# Altium schematic sheet MyFly1.SchDoc: MyFly
size A4; Author: Xuedong; DocumentNumber: 1; Revision: V1.0; SheetNumber: 1; SheetTotal: 2
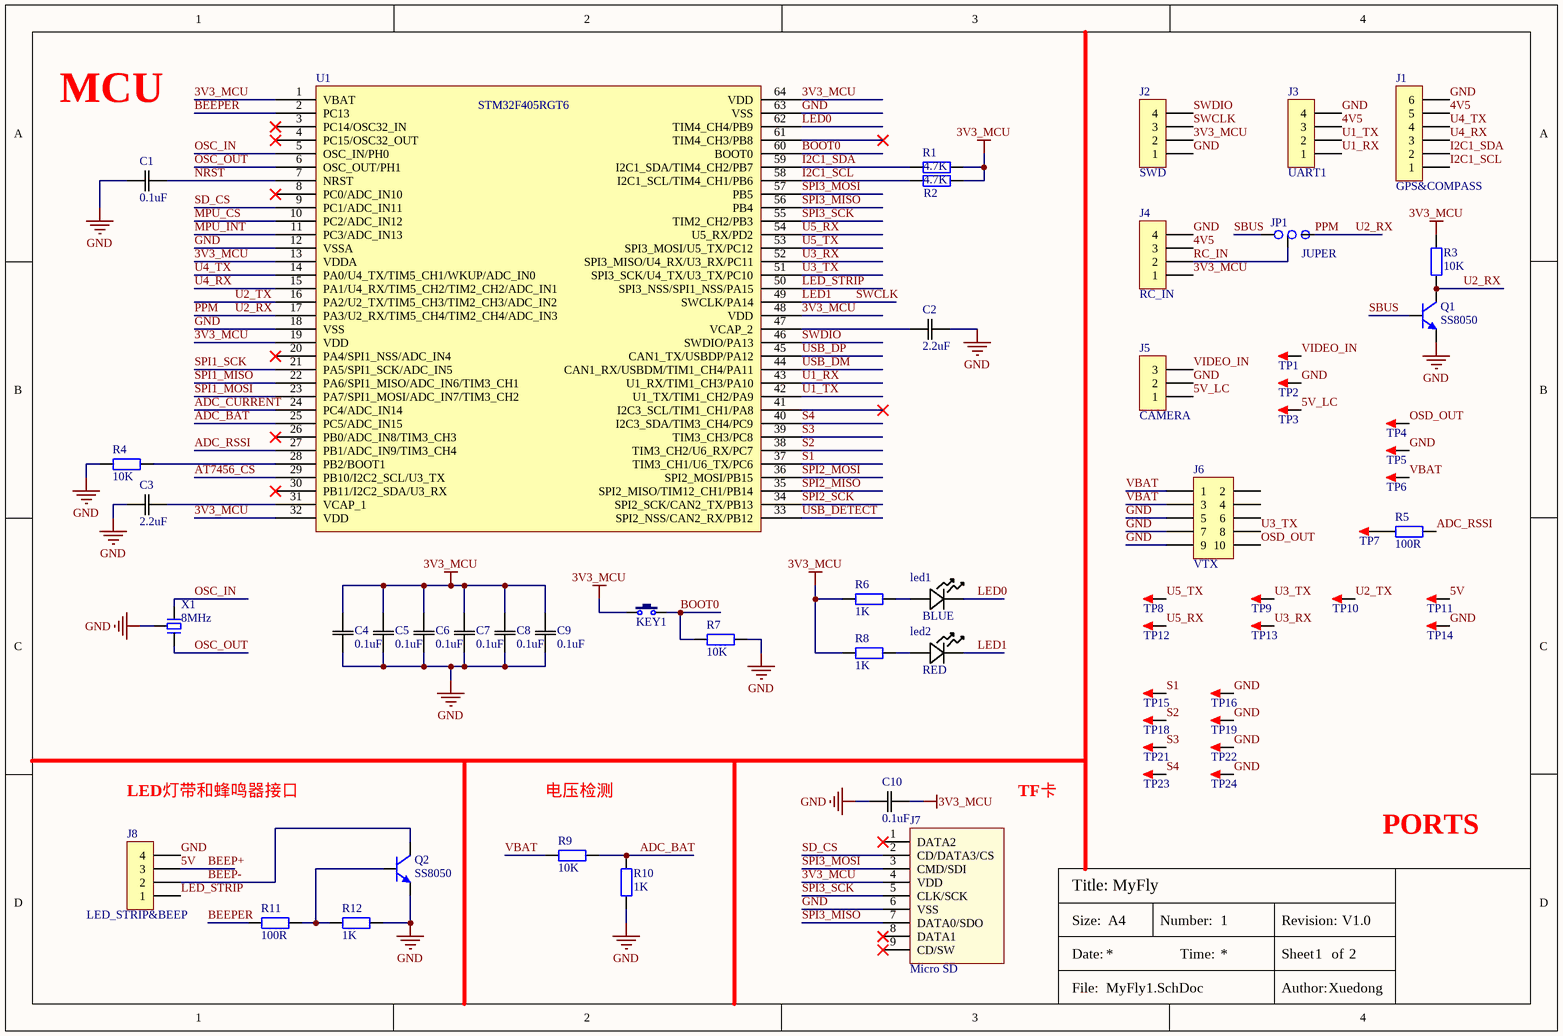
[diagram p0: MyFly1.SchDoc]

## Parts
C1  0.1uF  [CAP_0402]
C2  2.2uF  [CAP_0402]
C3  2.2uF  [CAP_0402]
C4  0.1uF  [CAP_0402]
C5  0.1uF  [CAP_0402]
C6  0.1uF  [CAP_0402]
C7  0.1uF  [CAP_0402]
C8  0.1uF  [CAP_0402]
C9  0.1uF  [CAP_0402]
C10  0.1uF  [CAP_0603]
J1  GPS&COMPASS  [SH1.0 S-W-6P]
J2  SWD  [SH1.0 S-W-4P]
J3  UART1  [SH1.0 S-W-4P]
J4  RC_IN  [SH1.0 S-W-4P]
J5  CAMERA  [MX 1.25-WS-3P]
J6  VTX  [HDR1.27 2x5-M-SMD]
J7  Micro SD  [MICRO SD]
J8  LED_STRIP&BEEP  [SH1.0 S-W-4P]
JP1  JUPER  [JUMPER 3P]
KEY1  KEY  [KEY_TSW 2*4*3.5-S-W]  (value not drawn)
led1  BLUE  [LED_0603]
led2  RED  [LED_0603]
Q1  SS8050  [SOT23-3L]
Q2  SS8050  [SOT23-3L]
R1  4.7K  [Res_0402]
R2  4.7K  [Res_0402]
R3  10K  [Res_0402]
R4  10K  [Res_0402]
R5  100R  [Res_0402]
R6  1K  [Res_0402]
R7  10K  [Res_0402]
R8  1K  [Res_0402]
R9  10K  [RES_0603]
R10  1K  [RES_0603]
R11  100R  [Res_0402]
R12  1K  [Res_0402]
TP1  TEST  [TEST PAD 1.8]  (value not drawn)
TP2  TEST  [TEST PAD 1.8]  (value not drawn)
TP3  TEST  [TEST PAD 1.8]  (value not drawn)
TP4  TEST  [TEST PAD 1.8]  (value not drawn)
TP5  TEST  [TEST PAD 1.8]  (value not drawn)
TP6  TEST  [TEST PAD 1.8]  (value not drawn)
TP7  TEST  [TEST PAD 1.8]  (value not drawn)
TP8  TEST  [TEST PAD 1.8]  (value not drawn)
TP9  TEST  [TEST PAD 1.8]  (value not drawn)
TP10  TEST  [TEST PAD 1.8]  (value not drawn)
TP11  TEST  [TEST PAD 1.8]  (value not drawn)
TP12  TEST  [TEST PAD 1.8]  (value not drawn)
TP13  TEST  [TEST PAD 1.8]  (value not drawn)
TP14  TEST  [TEST PAD 1.8]  (value not drawn)
TP15  TEST  [TEST PAD 1.8]  (value not drawn)
TP16  TEST  [TEST PAD 1.8]  (value not drawn)
TP18  TEST  [TEST PAD 1.8]  (value not drawn)
TP19  TEST  [TEST PAD 1.8]  (value not drawn)
TP21  TEST  [TEST PAD 1.8]  (value not drawn)
TP22  TEST  [TEST PAD 1.8]  (value not drawn)
TP23  TEST  [TEST PAD 1.8]  (value not drawn)
TP24  TEST  [TEST PAD 1.8]  (value not drawn)
U1  STM32F405RGT6  [LQFP-64]
X1  8MHz  [XTAL-3215-3P]

## Nets
3V3_MCU: C4.2(EPAD) C5.2(EPAD) C6.2(EPAD) C7.2(EPAD) C8.2(EPAD) C9.2(EPAD) C10.2(EPAD) J2.2 J4.1 J7.4(VDD) KEY1.1 R1.2 R2.2 R3.2 R6.1 R8.1 U1.1(VBAT) U1.13(VDDA) U1.19(VDD) U1.32(VDD) U1.48(VDD) U1.64(VDD)
GND: C1.1(EPAD) C2.2(EPAD) C3.1(EPAD) C4.1(EPAD) C5.1(EPAD) C6.1(EPAD) C7.1(EPAD) C8.1(EPAD) C9.1(EPAD) C10.1(EPAD) J1.6 J2.1 J3.4 J4.4 J5.2 J6.5 J6.7 J6.9 J7.6(VSS) J8.4 Q1.2(E) Q2.2(E) R4.1 R7.2 R10.1 R12.2 TP2.1 TP5.1 TP14.1 TP16.1 TP19.1 TP22.1 TP24.1 U1.12(VSSA) U1.18(VSS) U1.63(VSS) X1.2
4V5: J1.5 J3.3 J4.3
5V: J8.3 TP11.1  [also labelled BEEP+]
5V_LC: J5.1 TP3.1
ADC_BAT: R9.2 R10.2 U1.25(PC5/ADC_IN15)
ADC_CURRENT: U1.24(PC4/ADC_IN14)
ADC_RSSI: R5.2 U1.27(PB1/ADC_IN9/TIM3_CH4)
AT7456_CS: U1.29(PB10/I2C2_SCL/U3_TX)
BEEP-: J8.2 Q2.3(C)
BEEPER: R11.1 U1.2(PC13)
BOOT0: KEY1.2 R7.1 U1.60(BOOT0)
I2C1_SCL: J1.1 R2.1 U1.58(I2C1_SCL/TIM4_CH1/PB6)
I2C1_SDA: J1.2 R1.1 U1.59(I2C1_SDA/TIM4_CH2/PB7)
LED0: led1.1 U1.62(TIM4_CH4/PB9)
LED1: J2.3 led2.1 U1.49(SWCLK/PA14)  [also labelled SWCLK]
LED_STRIP: J8.1 U1.50(SPI3_NSS/SPI1_NSS/PA15)
MPU_CS: U1.10(PC2/ADC_IN12)
MPU_INT: U1.11(PC3/ADC_IN13)
NRST: C1.2(EPAD) U1.7(NRST)
OSC_IN: U1.5(OSC_IN/PH0) X1.1
OSC_OUT: U1.6(OSC_OUT/PH1) X1.3
OSD_OUT: J6.10 TP4.1
PPM: JP1.3 Q1.3(C) R3.1 U1.17(PA3/U2_RX/TIM5_CH4/TIM2_CH4/ADC_IN3)  [also labelled U2_RX]
RC_IN: J4.2 JP1.2
S1: TP15.1 U1.37(TIM3_CH1/U6_TX/PC6)
S2: TP18.1 U1.38(TIM3_CH2/U6_RX/PC7)
S3: TP21.1 U1.39(TIM3_CH3/PC8)
S4: TP23.1 U1.40(I2C3_SDA/TIM3_CH4/PC9)
SBUS: JP1.1 Q1.1(B)
SD_CS: J7.2(CD/DATA3/CS) U1.9(PC1/ADC_IN11)
SPI1_MISO: U1.22(PA6/SPI1_MISO/ADC_IN6/TIM3_CH1)
SPI1_MOSI: U1.23(PA7/SPI1_MOSI/ADC_IN7/TIM3_CH2)
SPI1_SCK: U1.21(PA5/SPI1_SCK/ADC_IN5)
SPI2_MISO: U1.35(SPI2_MISO/TIM12_CH1/PB14)
SPI2_MOSI: U1.36(SPI2_MOSI/PB15)
SPI2_SCK: U1.34(SPI2_SCK/CAN2_TX/PB13)
SPI3_MISO: J7.7(DATA0/SDO) U1.56(PB4)
SPI3_MOSI: J7.3(CMD/SDI) U1.57(PB5)
SPI3_SCK: J7.5(CLK/SCK) U1.55(TIM2_CH2/PB3)
SWDIO: J2.4 U1.46(SWDIO/PA13)
U1_RX: J3.1 U1.43(U1_RX/TIM1_CH3/PA10)
U1_TX: J3.2 U1.42(U1_TX/TIM1_CH2/PA9)
U2_TX: TP10.1 U1.16(PA2/U2_TX/TIM5_CH3/TIM2_CH3/ADC_IN2)
U3_RX: TP13.1 U1.52(SPI3_MISO/U4_RX/U3_RX/PC11)
U3_TX: J6.8 TP9.1 U1.51(SPI3_SCK/U4_TX/U3_TX/PC10)
U4_RX: J1.3 U1.15(PA1/U4_RX/TIM5_CH2/TIM2_CH2/ADC_IN1)
U4_TX: J1.4 U1.14(PA0/U4_TX/TIM5_CH1/WKUP/ADC_IN0)
U5_RX: TP12.1 U1.54(U5_RX/PD2)
U5_TX: TP8.1 U1.53(SPI3_MOSI/U5_TX/PC12)
USB_DETECT: U1.33(SPI2_NSS/CAN2_RX/PB12)
USB_DM: U1.44(CAN1_RX/USBDM/TIM1_CH4/PA11)
USB_DP: U1.45(CAN1_TX/USBDP/PA12)
VBAT: J6.1 J6.3 R9.1 TP6.1
VIDEO_IN: J5.3 TP1.1
NetC2_1: C2.1(EPAD) U1.47(VCAP_2)
NetC3_2: C3.2(EPAD) U1.31(VCAP_1)
Netled1_2: led1.2 R6.2
Netled2_2: led2.2 R8.2
NetQ2_1: Q2.1(B) R11.2 R12.1
NetR4_2: R4.2 U1.28(PB2/BOOT1)
NetR5_1: R5.1 TP7.1

Not connected (* = marked no-connect by the designer): J6 2 4 6; J7 1(DATA2)* 8(DATA1)* 9(CD/SW)*; U1 3(PC14/OSC32_IN)* 4(PC15/OSC32_OUT)* 8(PC0/ADC_IN10)* 20(PA4/SPI1_NSS/ADC_IN4)* 26(PB0/ADC_IN8/TIM3_CH3)* 30(PB11/I2C2_SDA/U3_RX)* 41(I2C3_SCL/TIM1_CH1/PA8)* 61(TIM4_CH3/PB8)*

## Notes on the sheet
- MCU
- LED灯带和蜂鸣器接口
- 电压检测
- TF卡
- PORTS
- Title:
- Size:  A4
- Number:
- Revision:
- Date:
- Time:
- Sheet     of
- File:
- Author:

## Library data of the parts
C1-C10 = CAP: 无极性贴片电容; Manufacturer_Part_Number: 04023A0R3BAT2A; Vendor: AVX Corporation; Built_By: EMA_UL_Team; Type: DEV; C: Copyright (C) 2016 Accelerated Designs. All rights reserved; Copyright: Copyright (C) 2016 Accelerated Designs. All rights reserved; RefDes: RefDes; Value: Value
J1 = Header_1x6: 6P接插件; Manufacturer_Part_Number: 826629-6; Vendor: TE Connectivity; Built_By: EMA_UL_Team; C: Copyright (C) 2015 Accelerated Designs. All rights reserved; RefDes: RefDes; Type: DEV; Value: Value
J2-J4 J8 = Header_1x4: 4P接插件; Manufacturer_Part_Number: 826629-4; Vendor: TE Connectivity; Built_By: EMA_UL_Team; C: Copyright (C) 2015 Accelerated Designs. All rights reserved; RefDes: RefDes; Type: DEV; Value: Value
J5 = Header_1x3: 3P接插件; Manufacturer_Part_Number: 826629-3; Vendor: TE Connectivity; Built_By: EMA_UL_Team; C: Copyright (C) 2015 Accelerated Designs. All rights reserved; RefDes: RefDes; Type: DEV; Value: Value
J6 = Header_2x5: 2x5P-接插件; Manufacturer_Part_Number: 826656-5; Vendor: TE Connectivity; Built_By: EMA_UL_Team; C: Copyright (C) 2015 Accelerated Designs. All rights reserved; RefDes: RefDes; Type: DEV; Value: Value
J7 = Micro SD: Micro SD卡; 版权归属: 源创客; BOM名称: Micro SD卡; 学习资源: www.ooocke.com
JP1 = JUMPER 3P: 三点焊盘跳线
KEY1 = KEY: 按键; BOM名称: 3x6轻触开关; 版权归属: 源创客; 学习资源: www.ooocke.com
led1 led2 = LED: 贴片发光二极管; Manufacturer_Part_Number: VLMB1310-GS08; Vendor: Vishay; Built_By: EMA_UL_Team; Type: DEV; C: Copyright (C) 2015 Accelerated Designs. All rights reserved; RefDes: RefDes; Value: Value
Q1 Q2 = S8050-SMD: 高频放大-NPN型; 版权归属: 源创客; 属性: 40V 1.5A 1W 100MHZ; BOM名称: 高频放大-NPN型; 学习资源: www.ooocke.com
R1-R12 = RES: 贴片电阻; Manufacturer_Part_Number: RC0402FR-070RL; Vendor: Yageo; Built_By: EMA_UL_Team; C: Copyright (C) 2015 Accelerated Designs. All rights reserved; RefDes: RefDes; Type: DEV; Value: Value
TP1-TP16 TP18 TP19 TP21-TP24 = TEST: 测试点; 版权归属: 源创客; BOM名称: 测试点; 学习资源: www.ooocke.com
U1 = STM32F405RGT6: Flaah:256/RAM:48/IO:51
X1 = XTAL-3P: 3脚无源晶振; BOM名称: 2脚晶振; 版权归属: 源创客; 学习资源: www.ooocke.com